# Altium schematic sheet LM2903+CAT5171TBI.SchDoc
size A4; SheetNumber: 14; SheetTotal: 17
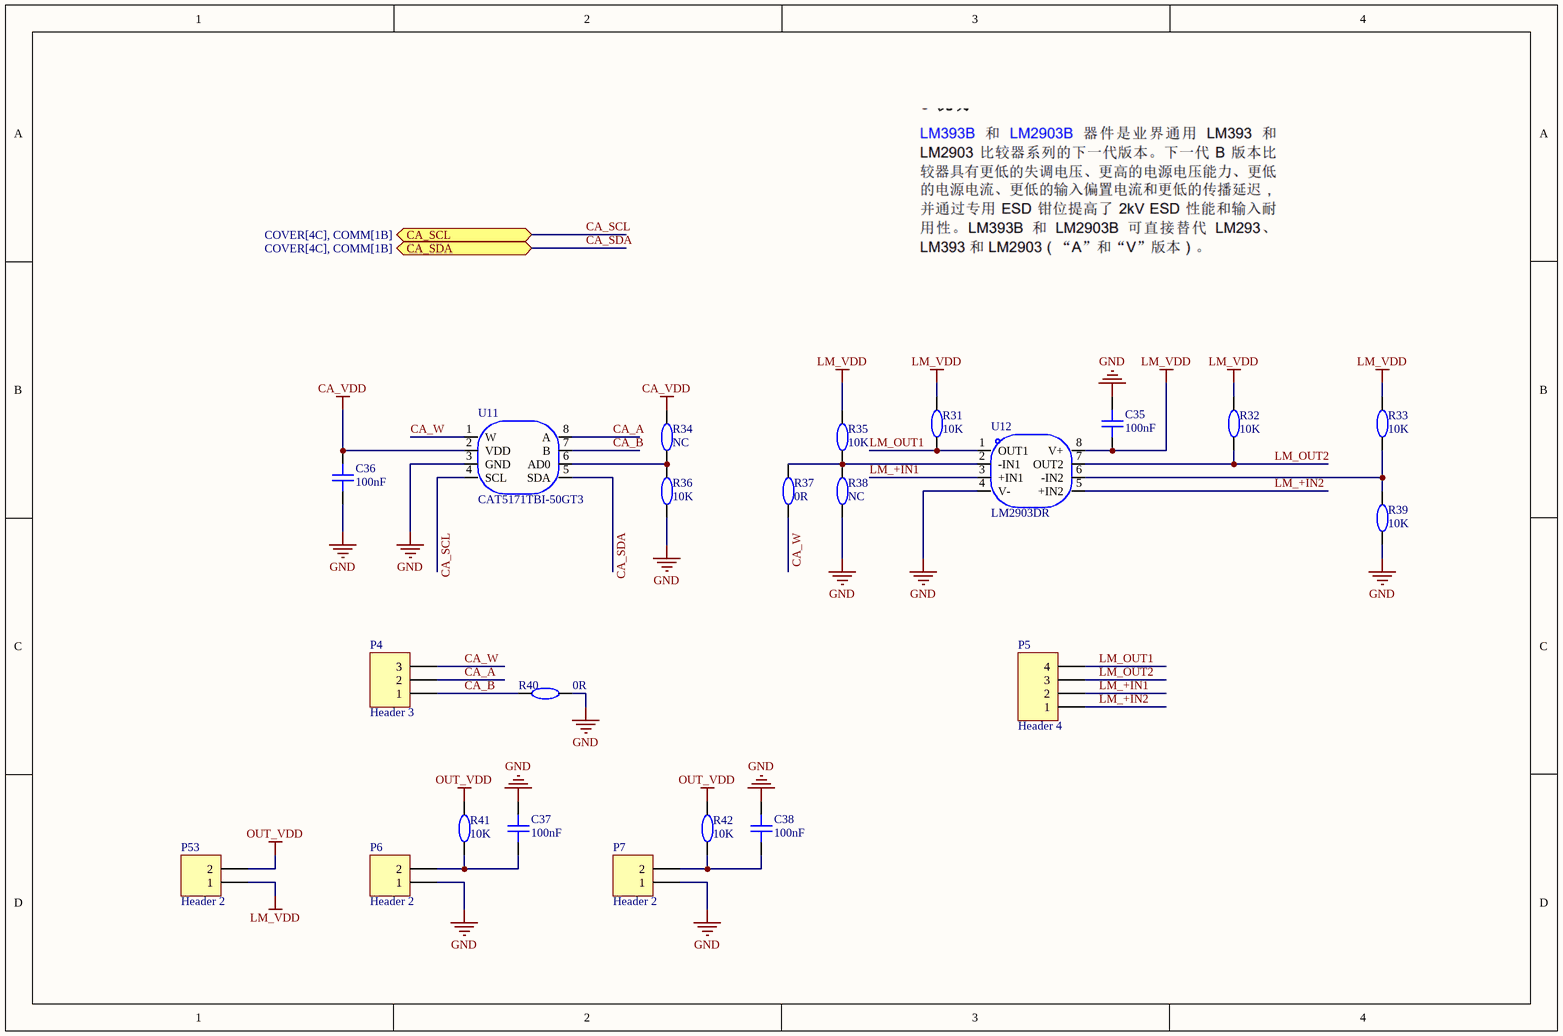
[diagram p0: LM2903+CAT5171TBI.SchDoc]

## Parts
C35  100nF  [C0402]
C36  100nF  [C0402]
C37  100nF  [C0402]
C38  100nF  [C0402]
P4  Header 3  [HDR1X3]
P5  Header 4  [HDR1X4]
P6  Header 2  [HDR1X2]
P7  Header 2  [HDR1X2]
P53  Header 2  [HDR1X2]
R31  10K  [R0402]
R32  10K  [R0402]
R33  10K  [R0603]
R34  NC  [R0402]
R35  10K  [R0603]
R36  10K  [R0402]
R37  0R  [R0603]
R38  NC  [R0603]
R39  10K  [R0603]
R40  0R  [R0603]
R41  10K  [R0402]
R42  10K  [R0402]
U11  CAT5171TBI-50GT3  [SOT-23-8_L3.0-W1.7-P0.65-LS2.8-BR]
U12  LM2903DR  [SOIC-8_L5.0-W4.0-P1.27-LS6.0-BL]

## Ports
CA_SCL (bidir, see COVER[4C], COMM[1B]), CA_SDA (bidir, see COVER[4C], COMM[1B])

## Nets
CA_VDD: C36.2 R34.2 U11.2(VDD)
GND: C35.2 C36.1 C37.2 C38.2 P6.1 P7.1 R36.1 R38.1 R39.1 R40.1 U11.3(GND) U12.4(V-)
LM_VDD: C35.1 P53.1 R31.2 R32.2 R33.2 R35.2 U12.8(V+)
OUT_VDD: P53.2 R41.2 R42.2
CA_A: P4.2 U11.8(A)
CA_B: P4.1 R40.2 U11.7(B)
CA_SCL: U11.4(SCL) ; port CA_SCL
CA_SDA: U11.5(SDA) ; port CA_SDA
CA_W: P4.3 R37.1 U11.1(W)
LM_+IN1: P5.2 U12.3(+IN1)
LM_+IN2: P5.1 U12.5(+IN2)
LM_OUT1: P5.4 R31.1 U12.1(OUT1)
LM_OUT2: P5.3 R32.1 U12.7(OUT2)
NetC37_1: C37.1 P6.2 R41.1
NetC38_1: C38.1 P7.2 R42.1
NetR33_1: R33.1 R39.2 U12.6(-IN2)
NetR34_1: R34.1 R36.2 U11.6(AD0)
NetR35_1: R35.1 R37.2 R38.2 U12.2(-IN1)

## Library data of the parts
C35-C38 = CAP_0402: Symbol: CapAcitance; Device: CAP_0603; Convert to PCB: yes; Add into BOM: yes; Supplier Footprint: 0603; Value: 100nF; Name: 100nF
P4 = Header 3: Header, 3-Pin; LatestRevisionDate: 17-Jul-2002; LatestRevisionNote: Re-released for DXP Platform.; Publisher: Altium Limited
P5 = Header 4: Header, 4-Pin; LatestRevisionDate: 17-Jul-2002; LatestRevisionNote: Re-released for DXP Platform.; Publisher: Altium Limited
P6 P7 P53 = Header 2: Header, 2-Pin; LatestRevisionDate: 17-Jul-2002; LatestRevisionNote: Re-released for DXP Platform.; Publisher: Altium Limited
R31 R32 R34 R36 R41 R42 = Res_0402: Symbol: 电阻; Device: Res_0603; Convert to PCB: yes; Add into BOM: yes; Supplier Footprint: 0603
  R31 R32 R36 R41 R42: Value: 10K; Name: 10K
  R34: Value: NC; Name: NC
R33 R35 R37-R40 = Res_0603: Symbol: 电阻; Convert to PCB: yes; Device: Res_0603; Add into BOM: yes; Supplier Footprint: 0603
  R33 R35 R39: Value: 10K; Name: 10K
  R37 R40: Value: 0R; Name: 0R
  R38: Value: NC; Name: NC
U11 = CAT5171TBI-50GT3: Manufacturer: onsemi(安森美); Add into BOM: yes; Resistance Value (Ohms): 50kΩ; Number of Taps: 256; Number of Channels: 1; Tolerance: ±20%; Voltage - Supply: 2.7V~5.5V; Interface: I2C; Temperature Coefficient(Typ): ±100ppm/℃; Symbol: CAT5171TBI-50GT3; Device: CAT5171TBI-50GT3; LCSC Part Name: CAT5171TBI-50GT3; Supplier Part: C154777; Manufacturer Part: CAT5171TBI-50GT3; Supplier Footprint: SOT-23-8; JLCPCB Part Class: 扩展库; Datasheet: https://atta.szlcsc.com/upload/public/pdf/source/20180112/C154777_15157258174431261651.PDF; Supplier: LCSC; Convert to PCB: yes; Operating Temperature: -40℃~+85℃; Name: CAT5171TBI-50GT3
U12 = LM2903DR: Manufacturer: TI(德州仪器); Symbol: LM2903DRG4; Add into BOM: yes; Input Offset Voltage (Vos): 7mV; Input Bias Current (Ib): 250nA; Supply Voltage: 1V~18V；2V~36V; Output Type: 开集; Supply Current: 2.5mA; Device: LM2903DR; LCSC Part Name: 双路差分比较器; Supplier Part: C7549; Manufacturer Part: LM2903DR; Supplier Footprint: SOIC-8; JLCPCB Part Class: 扩展库; Datasheet: https://www.ti.com/cn/lit/gpn/lm293; Supplier: LCSC; Convert to PCB: yes; Input Hysteresis Voltage (Vhys): -; Common Mode Rejection Ratio (CMRR): -; Output Mode: -; Operating Temperature: -40℃~+125℃; Name: LM2903DR